# Altium project Mirny.PrjPCB (part 1 of 4)
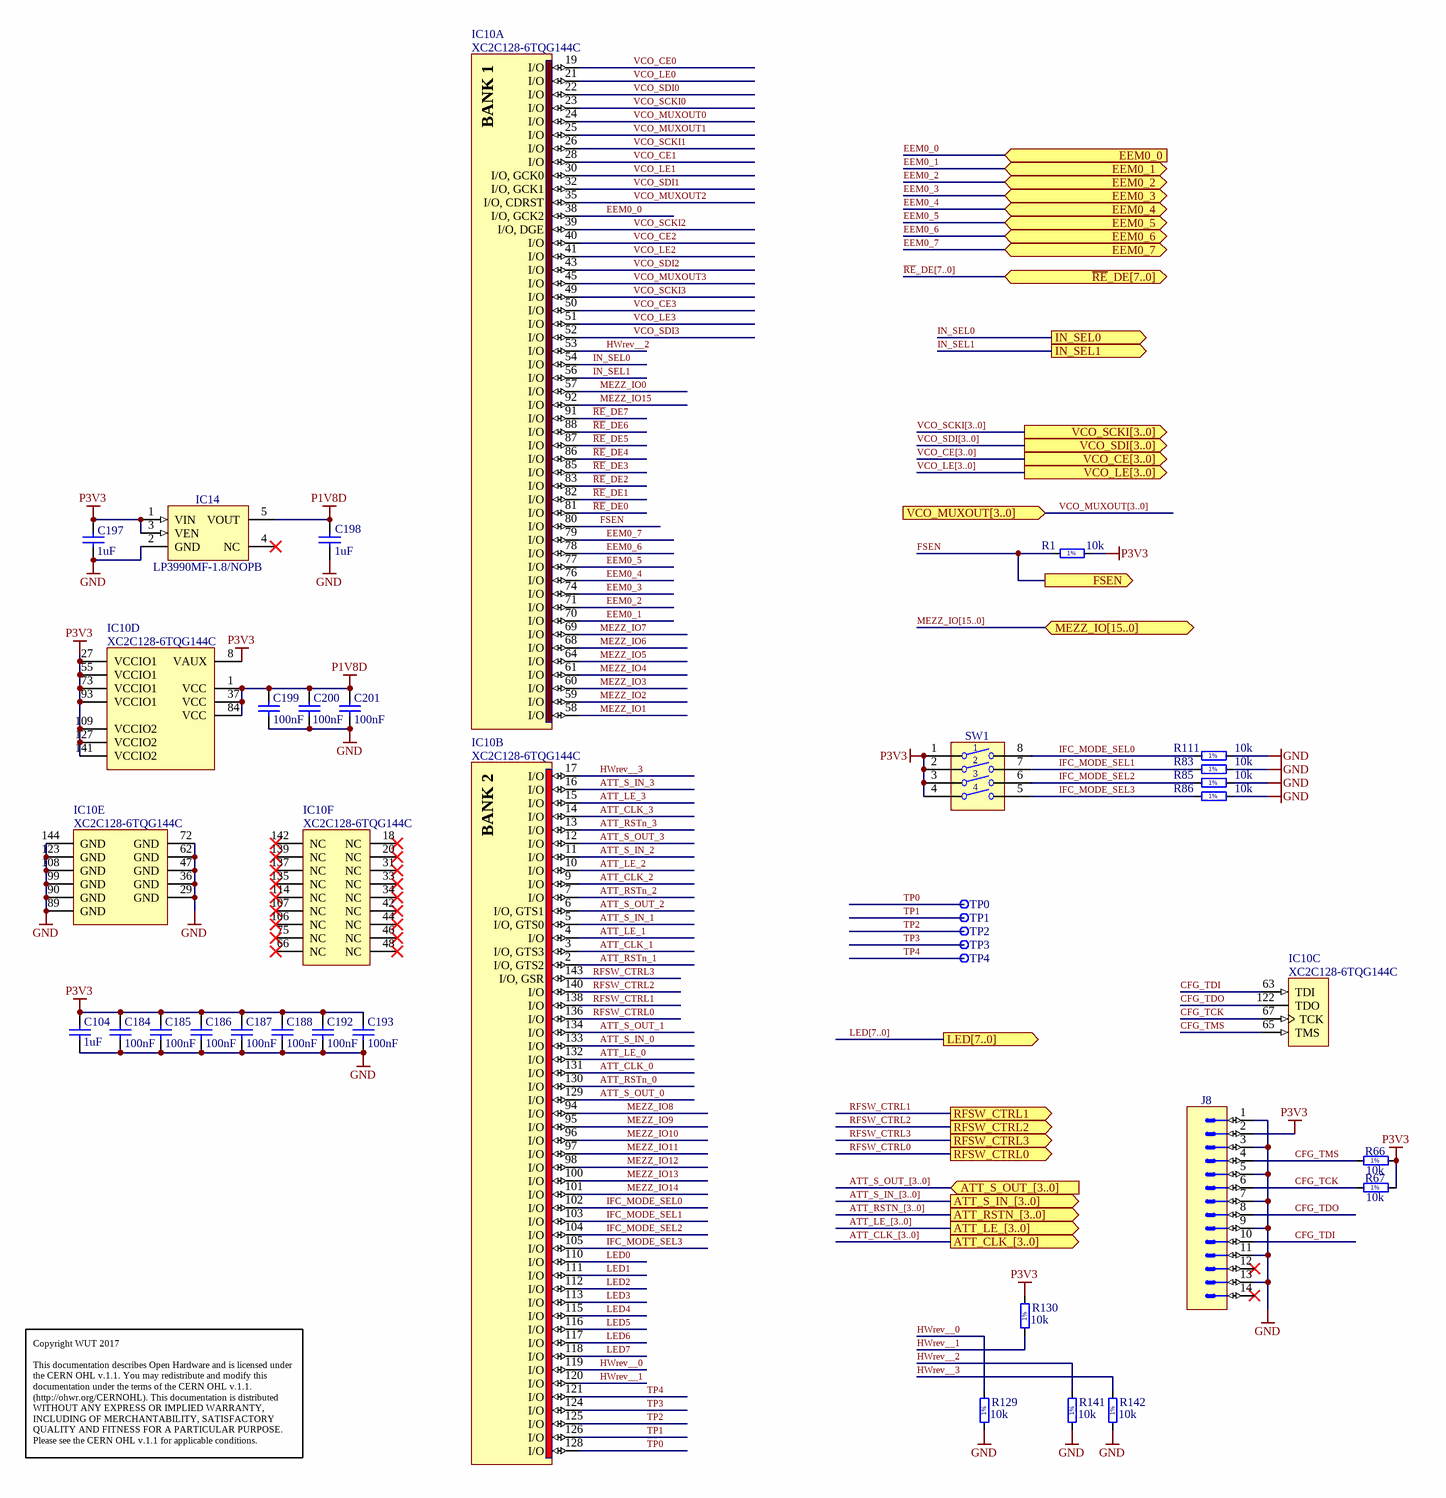
[diagram p0: CTRL_LOGIC.SchDoc]
P_version: 1.1.4
8 sheets, 822 parts. Net scope: hierarchical (ports join the sheet entries above them; power ports are global).
Board file: Mirny.PcbDoc
Sheets:
  CTRL_LOGIC.SchDoc
  Mirny.schdoc
    U_VCO_channel0 = VCO_channel.SchDoc
    U_VCO_OUT_channel0 = VCO_OUT_channel.SchDoc
    U_VCO_OUT_channel1 = VCO_OUT_channel.SchDoc
    U_VCO_OUT_channel2 = VCO_OUT_channel.SchDoc
    U_VCO_OUT_channel3 = VCO_OUT_channel.SchDoc
    U_VCO_channel1 = VCO_channel.SchDoc
    U_VCO_channel2 = VCO_channel.SchDoc
    U_VCO_channel3 = VCO_channel.SchDoc
    U_CLK_INPUT = CLK_INPUT.SchDoc
    U_B2B_Connectors = B2B_connectors.SchDoc
  LVDS_IFC_VCO.SchDoc
  Supply_Mirny.SchDoc

## Sheet CTRL_LOGIC.SchDoc: CPLD logic
size 420 x 297 mm; Author: K.B.; CompanyName: WUT; DrawnBy: K.B.; Organization: WUT ISE; Address1: Warsaw Univeristy of Technology; Address2: Nowowiejska 15/19; DocumentNumber: 2; Revision: 1.1.4; SheetNumber: 2; SheetTotal: 8; EDA_Number: ARTIQ; Projet: ARTIQ/SINARA; ModifiedBy: -; CreateDate: XX/XX/XXXX; CheckedDate: -; Title2: & option switches; DivGrp: ISE; Designer: K.B.; ModifiedDate: -; ProjectName: ARTIQ/SINARA

### Parts
(Parts that share a designator on the sheet are numbered #1, #2 ... from top to bottom, then left to right.)
C104  1uF  [CAPC1005X55N]
C184  100nF  [CAPC1005X55N]
C185  100nF  [CAPC1005X55N]
C186  100nF  [CAPC1005X55N]
C187  100nF  [CAPC1005X55N]
C188  100nF  [CAPC1005X55N]
C192  100nF  [CAPC1005X55N]
C193  100nF  [CAPC1005X55N]
C197  1uF  [CAPC1005X55N]
C198  1uF  [CAPC1005X55N]
C199  100nF  [CAPC1005X55N]
C200  100nF  [CAPC1005X55N]
C201  100nF  [CAPC1005X55N]
IC10  XC2C128-6TQG144C  [QFP50P2200X2200X160-144N]  (parts A,B,C,D,E,F of 6)
IC14  LP3990MF-1.8/NOPB  [SOT95P284X122-5N]
J8  Milli-Grid™  [MOLEX_87832-1420]  (value not drawn)
R1#1  10k  [RESC1005X40N]
R66  10k  [RESC1005X40N]
R67  10k  [RESC1005X40N]
R83  10k  [RESC1005X40N]
R85  10k  [RESC1005X40N]
R86  10k  [RESC1005X40N]
R111  10k  [RESC1005X40N]
R129  10k  [RESC1005X40N]
R130  10k  [RESC1005X40N]
R141  10k  [RESC1005X40N]
R142  10k  [RESC1005X40N]
SW1  Switch  [SW_OMRON_A6S-4102-H]  (value not drawn)
TP0  Test Point  [TPS127]  (value not drawn)
TP1  Test Point  [TPS127]  (value not drawn)
TP2  Test Point  [TPS127]  (value not drawn)
TP3  Test Point  [TPS127]  (value not drawn)
TP4  Test Point  [TPS127]  (value not drawn)

### Ports
ATT_CLK_[3..0] (out), ATT_LE_[3..0] (out), ATT_RSTN_[3..0] (out), ATT_S_IN_[3..0] (out), ATT_S_OUT_[3..0] (in), EEM0_0 (in), EEM0_1 (bidir), EEM0_2 (bidir), EEM0_3 (bidir), EEM0_4 (bidir), EEM0_5 (bidir), EEM0_6 (bidir), EEM0_7 (bidir), FSEN (out), IN_SEL0 (out), IN_SEL1 (out), LED[7..0] (out), MEZZ_IO[15..0] (bidir), RFSW_CTRL0 (out), RFSW_CTRL1 (out), RFSW_CTRL2 (out), RFSW_CTRL3 (out), VCO_CE[3..0] (out), VCO_LE[3..0] (out), VCO_MUXOUT[3..0] (in), VCO_SCKI[3..0] (out), VCO_SDI[3..0] (out), ~{RE}_DE[7..0] (bidir)

### Nets
GND: C104.1 C184.1 C185.1 C186.1 C187.1 C188.1 C192.1 C193.1 C197.1 C198.1 C199.1 C200.1 C201.1 IC10.29(GND) IC10.36(GND) IC10.47(GND) IC10.62(GND) IC10.72(GND) IC10.89(GND) IC10.90(GND) IC10.99(GND) IC10.108(GND) IC10.123(GND) IC10.144(GND) IC14.2(GND) J8.1 J8.3 J8.5 J8.7 J8.9 J8.11 J8.13 R83.2 R85.2 R86.2 R111.2 R129.1 R141.1 R142.1
P1V8D: C198.2 C199.2 C200.2 C201.2 IC10.1(VCC) IC10.37(VCC) IC10.84(VCC) IC14.5(VOUT)
P3V3: C104.2 C184.2 C185.2 C186.2 C187.2 C188.2 C192.2 C193.2 C197.2 IC10.8(VAUX) IC10.27(VCCIO1) IC10.55(VCCIO1) IC10.73(VCCIO1) IC10.93(VCCIO1) IC10.109(VCCIO2) IC10.127(VCCIO2) IC10.141(VCCIO2) IC14.1(VIN) IC14.3(VEN) J8.2 R1#1.2 R66.2 R67.2 R130.2 SW1.1 SW1.2 SW1.3 SW1.4
ATT_CLK_0: IC10.131(I/O)
ATT_CLK_1: IC10.3(I/O,_GTS3)
ATT_CLK_2: IC10.9(I/O)
ATT_CLK_3: IC10.14(I/O)
ATT_LE_0: IC10.132(I/O)
ATT_LE_1: IC10.4(I/O)
ATT_LE_2: IC10.10(I/O)
ATT_LE_3: IC10.15(I/O)
ATT_RSTn_0: IC10.130(I/O)
ATT_RSTn_1: IC10.2(I/O,_GTS2)
ATT_RSTn_2: IC10.7(I/O)
ATT_RSTn_3: IC10.13(I/O)
ATT_S_IN_0: IC10.133(I/O)
ATT_S_IN_1: IC10.5(I/O,_GTS0)
ATT_S_IN_2: IC10.11(I/O)
ATT_S_IN_3: IC10.16(I/O)
ATT_S_OUT_0: IC10.129(I/O)
ATT_S_OUT_1: IC10.134(I/O)
ATT_S_OUT_2: IC10.6(I/O,_GTS1)
ATT_S_OUT_3: IC10.12(I/O)
CFG_TCK: IC10.67(TCK) J8.6 R67.1
CFG_TDI: IC10.63(TDI) J8.10
CFG_TDO: IC10.122(TDO) J8.8
CFG_TMS: IC10.65(TMS) J8.4 R66.1
EEM0_0: IC10.38(I/O,_GCK2) ; port EEM0_0
EEM0_1: IC10.70(I/O) ; port EEM0_1
EEM0_2: IC10.71(I/O) ; port EEM0_2
EEM0_3: IC10.74(I/O) ; port EEM0_3
EEM0_4: IC10.76(I/O) ; port EEM0_4
EEM0_5: IC10.77(I/O) ; port EEM0_5
EEM0_6: IC10.78(I/O) ; port EEM0_6
EEM0_7: IC10.79(I/O) ; port EEM0_7
FSEN: IC10.80(I/O) R1#1.1 ; port FSEN
HWrev__0: IC10.119(I/O) R129.2
HWrev__1: IC10.120(I/O) R130.1
HWrev__2: IC10.53(I/O) R141.2
HWrev__3: IC10.17(I/O) R142.2
IFC_MODE_SEL0: IC10.102(I/O) R111.1 SW1.8
IFC_MODE_SEL1: IC10.103(I/O) R83.1 SW1.7
IFC_MODE_SEL2: IC10.104(I/O) R85.1 SW1.6
IFC_MODE_SEL3: IC10.105(I/O) R86.1 SW1.5
IN_SEL0: IC10.54(I/O) ; port IN_SEL0
IN_SEL1: IC10.56(I/O) ; port IN_SEL1
LED0: IC10.110(I/O)
LED1: IC10.111(I/O)
LED2: IC10.112(I/O)
LED3: IC10.113(I/O)
LED4: IC10.115(I/O)
LED5: IC10.116(I/O)
LED6: IC10.117(I/O)
LED7: IC10.118(I/O)
MEZZ_IO0: IC10.57(I/O)
MEZZ_IO1: IC10.58(I/O)
MEZZ_IO2: IC10.59(I/O)
MEZZ_IO3: IC10.60(I/O)
MEZZ_IO4: IC10.61(I/O)
MEZZ_IO5: IC10.64(I/O)
MEZZ_IO6: IC10.68(I/O)
MEZZ_IO7: IC10.69(I/O)
MEZZ_IO8: IC10.94(I/O)
MEZZ_IO9: IC10.95(I/O)
MEZZ_IO10: IC10.96(I/O)
MEZZ_IO11: IC10.97(I/O)
MEZZ_IO12: IC10.98(I/O)
MEZZ_IO13: IC10.100(I/O)
MEZZ_IO14: IC10.101(I/O)
MEZZ_IO15: IC10.92(I/O)
~{RE}_DE0: IC10.81(I/O)
~{RE}_DE1: IC10.82(I/O)
~{RE}_DE2: IC10.83(I/O)
~{RE}_DE3: IC10.85(I/O)
~{RE}_DE4: IC10.86(I/O)
~{RE}_DE5: IC10.87(I/O)
~{RE}_DE6: IC10.88(I/O)
~{RE}_DE7: IC10.91(I/O)
RFSW_CTRL0: IC10.136(I/O) ; port RFSW_CTRL0
RFSW_CTRL1: IC10.138(I/O) ; port RFSW_CTRL1
RFSW_CTRL2: IC10.140(I/O) ; port RFSW_CTRL2
RFSW_CTRL3: IC10.143(I/O,_GSR) ; port RFSW_CTRL3
TP0: IC10.128(I/O) TP0.1
TP1: IC10.126(I/O) TP1.1
TP2: IC10.125(I/O) TP2.1
TP3: IC10.124(I/O) TP3.1
TP4: IC10.121(I/O) TP4.1
VCO_CE0: IC10.19(I/O)
VCO_CE1: IC10.28(I/O)
VCO_CE2: IC10.40(I/O)
VCO_CE3: IC10.50(I/O)
VCO_LE0: IC10.21(I/O)
VCO_LE1: IC10.30(I/O,_GCK0)
VCO_LE2: IC10.41(I/O)
VCO_LE3: IC10.51(I/O)
VCO_MUXOUT0: IC10.24(I/O)
VCO_MUXOUT1: IC10.25(I/O)
VCO_MUXOUT2: IC10.35(I/O,_CDRST)
VCO_MUXOUT3: IC10.45(I/O)
VCO_SCKI0: IC10.23(I/O)
VCO_SCKI1: IC10.26(I/O)
VCO_SCKI2: IC10.39(I/O,_DGE)
VCO_SCKI3: IC10.49(I/O)
VCO_SDI0: IC10.22(I/O)
VCO_SDI1: IC10.32(I/O,_GCK1)
VCO_SDI2: IC10.43(I/O)
VCO_SDI3: IC10.52(I/O)

Not connected (* = marked no-connect by the designer): IC10 18(NC)* 20(NC)* 31(NC)* 33(NC)* 34(NC)* 42(NC)* 44(NC)* 46(NC)* 48(NC)* 66(NC)* 75(NC)* 106(NC)* 107(NC)* 114(NC)* 135(NC)* 137(NC)* 139(NC)* 142(NC)*; IC14 4(NC)*; J8 12* 14*

### Buses and harness runs
bus ATT_CLK_[3..0] = port ATT_CLK_[3..0]
bus ATT_LE_[3..0] = port ATT_LE_[3..0]
bus ATT_RSTN_[3..0] = port ATT_RSTN_[3..0]
bus ATT_S_IN_[3..0] = port ATT_S_IN_[3..0]
bus ATT_S_OUT_[3..0] = port ATT_S_OUT_[3..0]
bus LED[7..0] = port LED[7..0]
bus MEZZ_IO[15..0] = port MEZZ_IO[15..0]
bus VCO_CE[3..0] = port VCO_CE[3..0]
bus VCO_LE[3..0] = port VCO_LE[3..0]
bus VCO_MUXOUT[3..0] = port VCO_MUXOUT[3..0]
bus VCO_SCKI[3..0] = port VCO_SCKI[3..0]
bus VCO_SDI[3..0] = port VCO_SDI[3..0]
bus ~{RE}_DE[7..0] = port ~{RE}_DE[7..0]

### Notes on the sheet
- Copyright WUT 2017
  This documentation describes Open Hardware and is licensed under the CERN OHL v.1.1. You may redistribute and modify this documentation under the terms of the CERN OHL v.1.1. (http://ohwr.org/CERNOHL). This documentation is distributed WITHOUT ANY EXPRESS OR IMPLIED WARRANTY, INCLUDING OF MERCHANTABILITY, SATISFACTORY QUALITY AND FITNESS FOR A PARTICULAR PURPOSE. Please see the CERN OHL v.1.1 for applicable conditions.
- Project/Equipment
- Document
- Designer
- Drawn by
- Check.by
- File
- Last Mod.
- Print Date
- Sheet
- Size
- A3
- of
- Rev
- (in symbol R0402_10K_1%_0.0625W_100PPM) 1%
- (in symbol XC2C128-6TQG144C, part A) BANK 1
- (in symbol XC2C128-6TQG144C, part B) BANK 2

### Library data of the parts
C104 C197 C198 = CC0402_1UF_16V_10%_X5R: Non-polarised capacitor; Part Description: SMD Multilayer Chip Ceramic Capacitor; Manufacturer: GENERIC; Manufacturer1 Part Number: C1005X5R1C105KT; Voltage: 16V; TC: X5R; Tolerance: ±10%; Part Number: CC0402_1UF_16V_10%_X5R; Component Kind: Standard; Component Type: Standard; Pin Count: 2; Value: 1uF; Status: Preferred; Manufacturer Part Number: CC0402_1UF_16V_10%_X5R; Case: 0402; Mounted: Yes; Socket: No; SMD: Yes; Sense: No; Manufacturer1 Example: TDK; Manufacturer1 ComponentHeight: 0.55mm; HelpURL: \\cern.ch\dfs\Applications\Altium\Datasheets\CC0402_X5R_TDK_C.pdf; Author: CERN DEM JLC; CreateDate: 2012-10-25; LatestRevisionDate: 2012-10-25
C184-C188 C192 C193 C199-C201 = CC0402_100NF_16V_10%_X5R: Non-polarised capacitor; Part Description: SMD Multilayer Chip Ceramic Capacitor; Manufacturer: GENERIC; Manufacturer1 Part Number: GRM155R61C104KA88D; Voltage: 16V; TC: X5R; Tolerance: ±10%; Part Number: CC0402_100NF_16V_10%_X5R; Component Kind: Standard; Component Type: Standard; Pin Count: 2; Value: 100nF; Status: None; Manufacturer Part Number: CC0402_100NF_16V_10%_X5R; Case: 0402; Mounted: Yes; Socket: No; SMD: Yes; Sense: No; Manufacturer1 Example: MURATA; Manufacturer1 ComponentHeight: 0.55mm; HelpURL: \\cern.ch\dfs\Applications\Altium\Datasheets\CC0402_X5R_MURATA_GRM.pdf; Author: CERN DEM JLC; CreateDate: 10.12.2013; LatestRevisionDate: 10.12.2013
IC10 = XC2C128-6TQG144C: CoolRunner-II 1.8V, 128 Macrocell CPLD, 100 User I/Os, 144-Pin TQFP, Commercial Grade, Pb-Free; Manufacturer: XILINX; PressFit: No; Bonding: No; Part Number: XC2C128-6TQG144C; Component Kind: Standard; Component Type: Standard; Device: XC2C128-6TQG144C; PackageDescription: QFP, 144-Leads, Body 20x20mm (BSC), Pitch 0.50mm, IPC Medium Density; Part Description: CoolRunner-II 1.8V, 128 Macrocell CPLD, 100 User I/Os, 144-Pin TQFP, Commercial Grade, Pb-Free; Manufacturer Part Number: XC2C128-6TQG144C; Pin Count: 144; Case: QFP144; Mounted: Yes; Socket: No; SMD: Yes; Sense: No; ComponentHeight: 1.6mm; HelpURL: \\cern.ch\dfs\Applications\Altium\Datasheets\XC2C128-6TQG144C.pdf; ComponentLink1URL: \\cern.ch\dfs\Applications\Altium\Datasheets\XC2C128-6TQG144C_Package.pdf; ComponentLink1Description: Package Drawing; Author: CERN DEM JLC; CreateDate: 16.11.2010; LatestRevisionDate: 16.11.2010
IC14 = LP3990MF-1.8/NOPB: 1.8V, 150mA Linear Voltage Regulator For Digital Applications; Manufacturer: TEXAS INSTRUMENTS; PressFit: No; Bonding: No; Part Number: LP3990MF-1.8/NOPB; Component Kind: Standard; Component Type: Standard; Device: LP3990MF-1.8/NOPB; PackageDescription: SOT23 5, Pitch 0.95mm - Body 1.67x2.99mm, IPC Medium Density; Part Description: 1.8V, 150mA Linear Voltage Regulator For Digital Applications; Manufacturer Part Number: LP3990MF-1.8/NOPB; Pin Count: 5; Case: SOT23-5; Mounted: Yes; Socket: No; SMD: Yes; Sense: No; ComponentHeight: 1.19mm; HelpURL: \\cern.ch\dfs\Applications\Altium\Datasheets\LP3990MF-1.8-NOPB.pdf; Author: CERN DEM JLC; CreateDate: 19.01.2011; LatestRevisionDate: 16.09.2014
J8 = MOLEX_87832-1420: Connector 14 Male; Part Description: 2.00mm (.079") Pitch Milli-Grid™ Header, Surface Mount, Vertical, Shrouded, 14 Circuits,with Locking Windows and Centre Polarization Slot, PCB Locator; Manufacturer: MOLEX; PressFit: No; Part Number: MOLEX_87832-1420; Component Kind: Standard; Component Type: Standard; Pin Count: 14; Family: Milli-Grid™; Mounted: Yes; Socket: No; SMD: Yes; Sense: No; Status: None; Manufacturer Part Number: 87832-1420; ComponentHeight: 7.6mm; HelpURL: \\cern.ch\dfs\Applications\Altium\Datasheets\MOLEX_87832-1420.pdf; Author: CERN DEM JLC; CreateDate: 09.09.2008; LatestRevisionDate: 09.09.2008
R1#1 R66 R67 R83 R85 R86 R111 R129 R130 R141 R142 = R0402_10K_1%_0.0625W_100PPM: Resistor - 1%; Part Description: General Purpose Thick Film Chip Resistor; Manufacturer: GENERIC; Manufacturer1 Part Number: 232270671003L; TC: ±100ppm/°C; Part Number: R0402_10K_1%_0.0625W_100PPM; Component Kind: Standard; Component Type: Standard; Pin Count: 2; Value: 10k; Status: Not recommended; Power: 0.0625W; Tolerance: ±1%; Manufacturer Part Number: R0402_10K_1%_0.0625W_100PPM; Case: 0402; Mounted: Yes; Sense: No; Socket: No; SMD: Yes; Manufacturer1 Example: YAGEO PHYCOMP; Manufacturer1 ComponentHeight: 0.4mm; HelpURL: \\cern.ch\dfs\Applications\Altium\Datasheets\R0402_Phycomp_RC0402.pdf; Author: CERN DEM JLC; CreateDate: 03.12.2007; LatestRevisionDate: 17.10.2012
SW1 = SW_OMRON_A6S-4102-H: 4 Ways SPST DIP Switch; Part Description: 4 Ways SPST DIP Switch, White Flat Actuator with Seal Tape, Contact Rating 25mA 24VDC; Manufacturer: OMRON; PressFit: No; Part Number: SW_OMRON_A6S-4102-H; Component Kind: Standard; Component Type: Standard; Pin Count: 8; PackageDescription: Pitch 2.54mm, Body 11.3x6.4mm, 4 Ways SPST Surface-Mounting DIP Switch, OMRON A6S-H; Family: Switch; Mounted: Yes; Socket: No; SMD: Yes; Sense: No; Status: None; Manufacturer Part Number: A6S-4102-H; ComponentHeight: 3.8mm; HelpURL: \\cern.ch\dfs\Applications\Altium\Datasheets\SW_OMRON_A6S-4102-H.pdf; Author: CERN DEM JMW; CreateDate: 25.09.2008; LatestRevisionDate: 25.09.2008
TP0-TP4 = SMD_PAD_1.27X1.27MM: Part Description: 1.27mm x 1.27mm PCB Copper Area (SMD Test Point); Mounted: No; Part Number: SMD_PAD_1.27X1.27MM; Component Kind: Standard (No BOM); Component Type: Standard (No BOM); Pin Count: 1; Family: Test Point; Socket: No; SMD: Yes; Sense: No; Status: None; ComponentHeight: 0mm; HelpURL: Undefined; Author: CERN DEM JLC; CreateDate: 12.01.2008; LatestRevisionDate: 12.01.2008; PackageDescription: 1.27mm x 1.27mm PCB Copper Area (SMD Test Point)

## Sheet Mirny.schdoc: Mirny
size A2; EDA_Number: ARTIQ; Projet: ARTIQ/SINARA; Author: M.Beldyga; CompanyName: WUT ISE; DrawnBy: K.B; Organization: WUT ISE; Address1: PW ISE; Address2: Nowowiejska 15/19 00-665 Warsaw; Address3: micbeldyga@gmail.com; SheetNumber: 1; SheetTotal: 10; ModifiedBy: M. Beldyga; CheckedDate: -; DivGrp: WUT ISE; Designer: K.B; ModifiedDate: -; ProjectName: Sensor Box
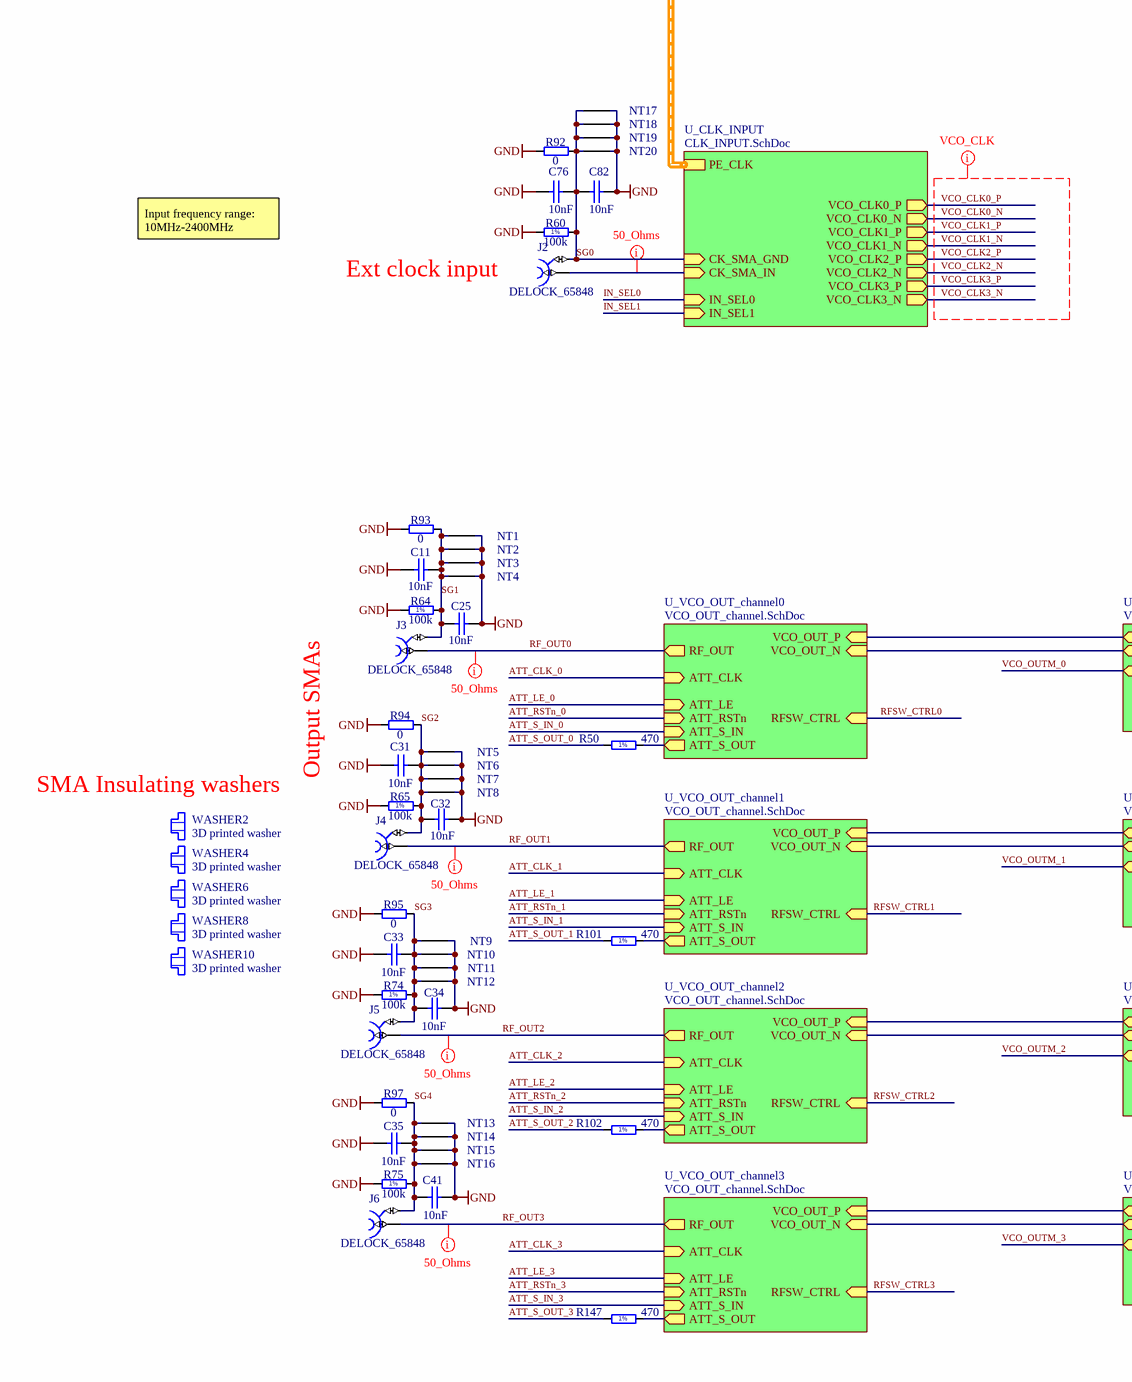
[diagram p1: Mirny.schdoc, left]
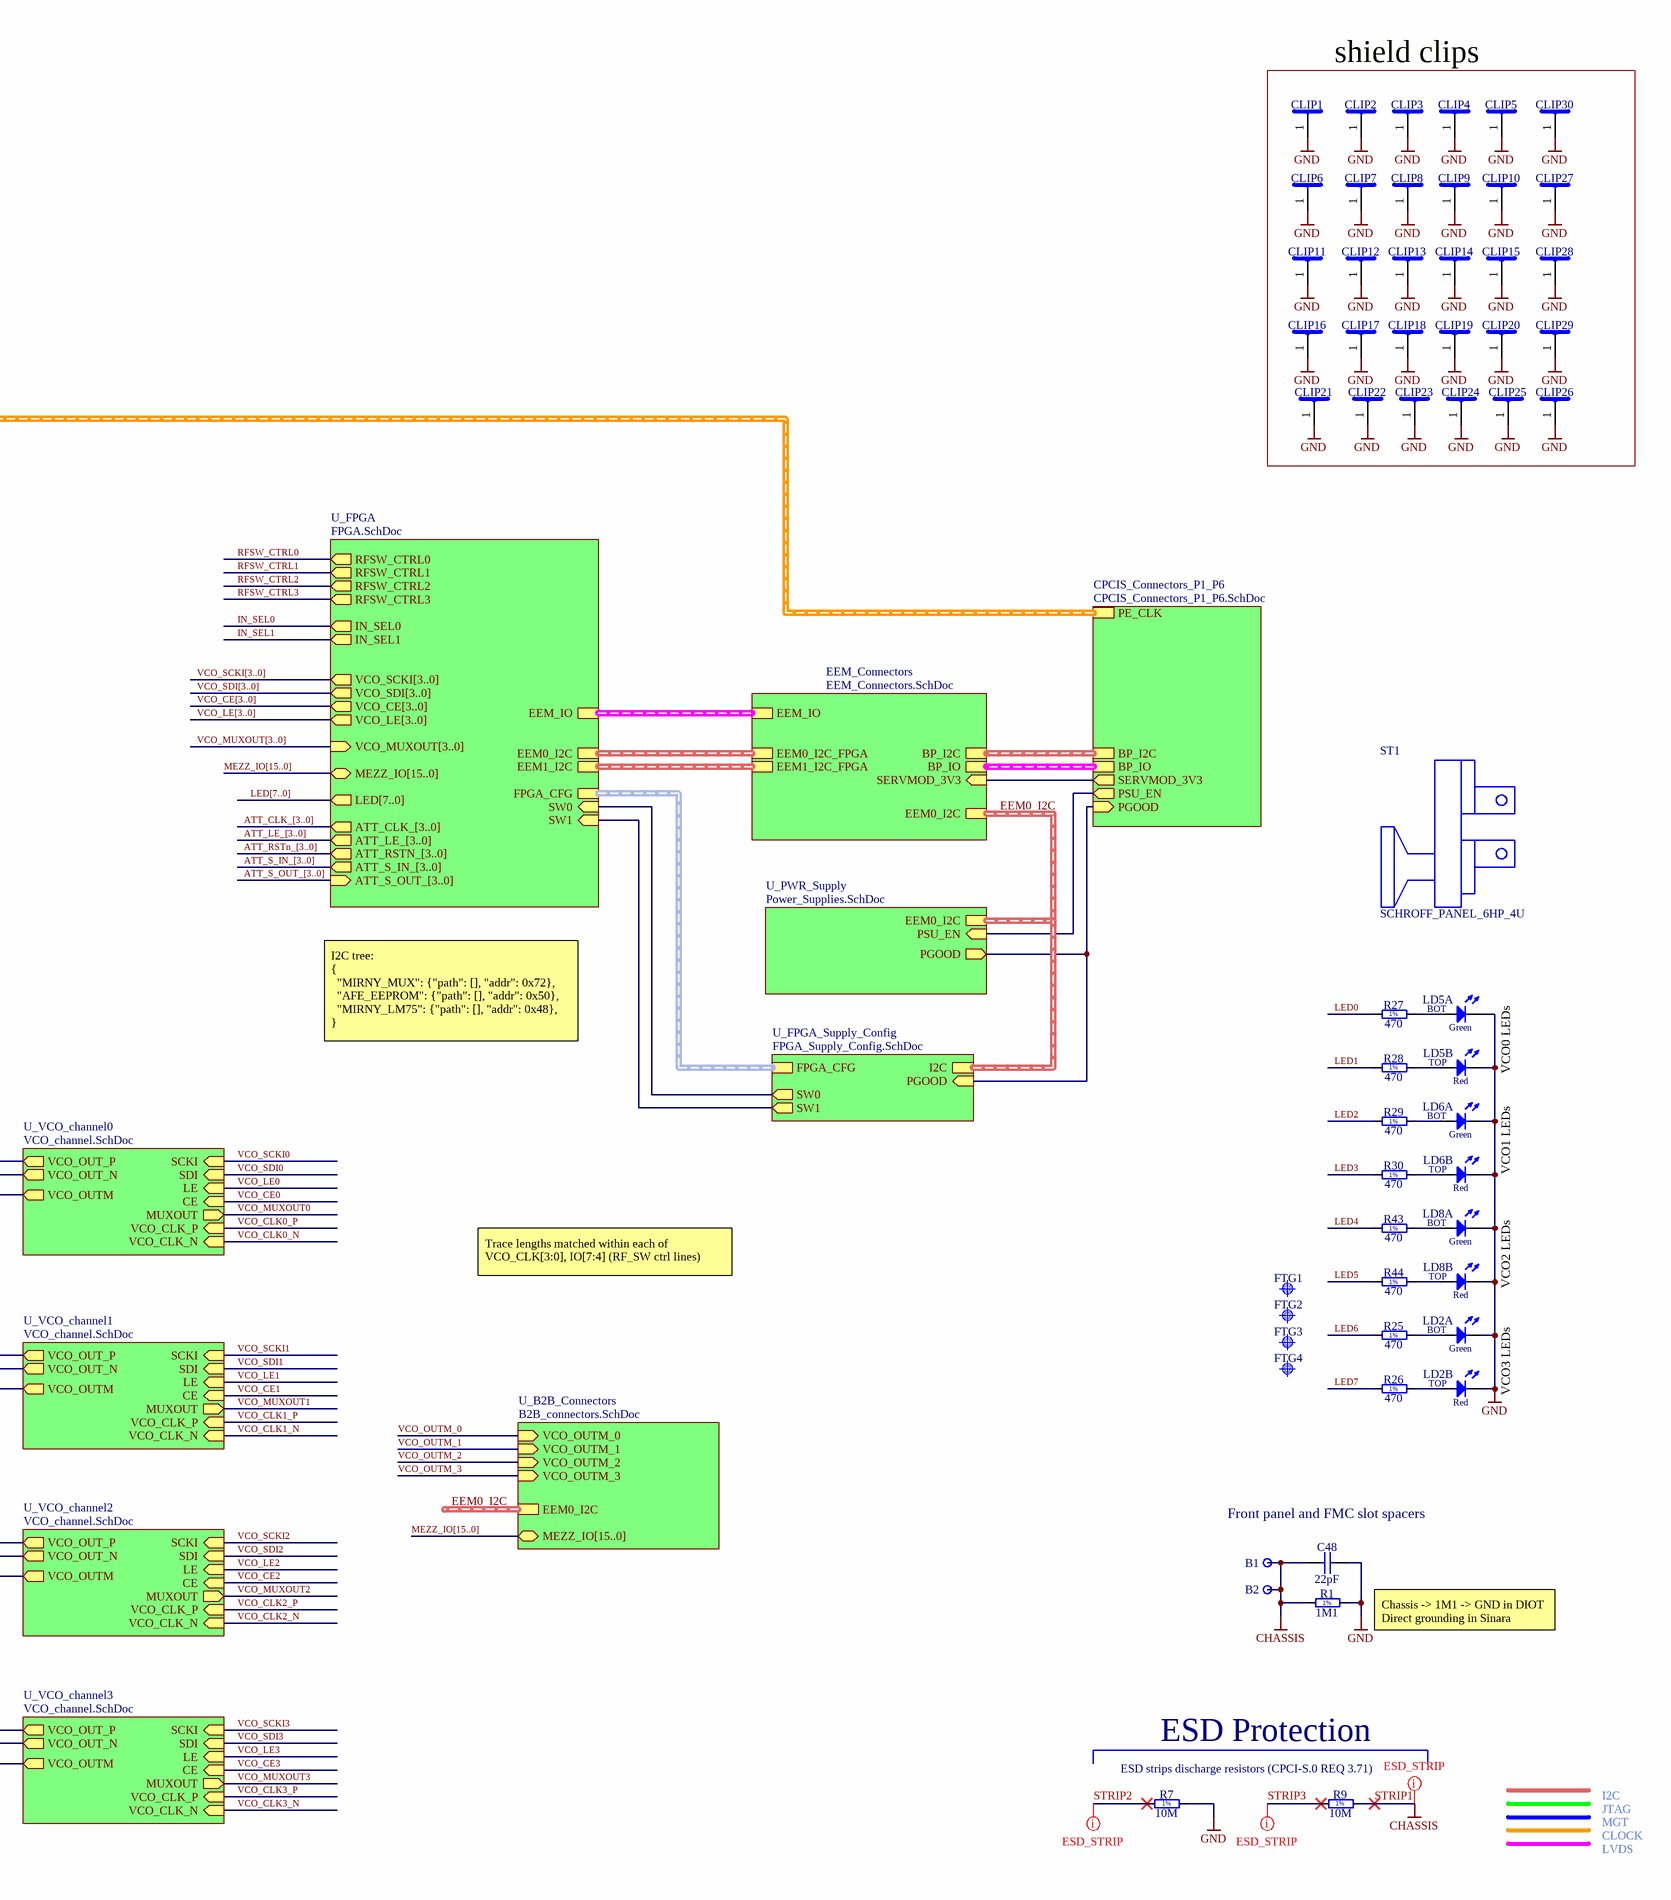
[diagram p2: Mirny.schdoc, right]

### Parts
(Parts that share a designator on the sheet are numbered #1, #2 ... from top to bottom, then left to right.)
B1  Plated Hole  [MTG270_500]  (value not drawn)  (no BOM)
B2  Plated Hole  [MTG270_500]  (value not drawn)  (no BOM)
C11  10nF  [CAPC1005X55N]
C25  10nF  [CAPC1005X55N]
C31  10nF  [CAPC1005X55N]
C32  10nF  [CAPC1005X55N]
C33  10nF  [CAPC1005X55N]
C34  10nF  [CAPC1005X55N]
C35  10nF  [CAPC1005X55N]
C41  10nF  [CAPC1005X55N]
C48#1  22pF  [CAPC1005X55N]
C76  10nF  [CAPC1005X55N]
C82  10nF  [CAPC1005X55N]
CLIP1  S1411-46R  [CLIP_HOLLAND-SHIELDING_LC]  (value not drawn)
CLIP2  S1411-46R  [CLIP_HOLLAND-SHIELDING_LC]  (value not drawn)
CLIP3  S1411-46R  [CLIP_HOLLAND-SHIELDING_LC]  (value not drawn)
CLIP4  S1411-46R  [CLIP_HOLLAND-SHIELDING_LC]  (value not drawn)
CLIP5  S1411-46R  [CLIP_HOLLAND-SHIELDING_LC]  (value not drawn)
CLIP6  S1411-46R  [CLIP_HOLLAND-SHIELDING_LC]  (value not drawn)
CLIP7  S1411-46R  [CLIP_HOLLAND-SHIELDING_LC]  (value not drawn)
CLIP8  S1411-46R  [CLIP_HOLLAND-SHIELDING_LC]  (value not drawn)
CLIP9  S1411-46R  [CLIP_HOLLAND-SHIELDING_LC]  (value not drawn)
CLIP10  S1411-46R  [CLIP_HOLLAND-SHIELDING_LC]  (value not drawn)
CLIP11  S1411-46R  [CLIP_HOLLAND-SHIELDING_LC]  (value not drawn)
CLIP12  S1411-46R  [CLIP_HOLLAND-SHIELDING_LC]  (value not drawn)
CLIP13  S1411-46R  [CLIP_HOLLAND-SHIELDING_LC]  (value not drawn)
CLIP14  S1411-46R  [CLIP_HOLLAND-SHIELDING_LC]  (value not drawn)
CLIP15  S1411-46R  [CLIP_HOLLAND-SHIELDING_LC]  (value not drawn)
CLIP16  S1411-46R  [CLIP_HOLLAND-SHIELDING_LC]  (value not drawn)
CLIP17  S1411-46R  [CLIP_HOLLAND-SHIELDING_LC]  (value not drawn)
CLIP18  S1411-46R  [CLIP_HOLLAND-SHIELDING_LC]  (value not drawn)
CLIP19  S1411-46R  [CLIP_HOLLAND-SHIELDING_LC]  (value not drawn)
CLIP20  S1411-46R  [CLIP_HOLLAND-SHIELDING_LC]  (value not drawn)
CLIP21  S1411-46R  [CLIP_HOLLAND-SHIELDING_LC]  (value not drawn)
CLIP22  S1411-46R  [CLIP_HOLLAND-SHIELDING_LC]  (value not drawn)
CLIP23  S1411-46R  [CLIP_HOLLAND-SHIELDING_LC]  (value not drawn)
CLIP24  S1411-46R  [CLIP_HOLLAND-SHIELDING_LC]  (value not drawn)
CLIP25  S1411-46R  [CLIP_HOLLAND-SHIELDING_LC]  (value not drawn)
CLIP26  S1411-46R  [CLIP_HOLLAND-SHIELDING_LC]  (value not drawn)
CLIP27  S1411-46R  [CLIP_HOLLAND-SHIELDING_LC]  (value not drawn)
CLIP28  S1411-46R  [CLIP_HOLLAND-SHIELDING_LC]  (value not drawn)
CLIP29  S1411-46R  [CLIP_HOLLAND-SHIELDING_LC]  (value not drawn)
CLIP30  S1411-46R  [CLIP_HOLLAND-SHIELDING_LC]  (value not drawn)
FTG1  Use only in PCB  [FIDUCIAL_TOP_C100-200]  (value not drawn)  (no BOM)
FTG2  Use only in PCB  [FIDUCIAL_TOP_S100-200]  (value not drawn)  (no BOM)
FTG3  Use only in PCB  [FIDUCIAL_TOP_S200-400]  (value not drawn)  (no BOM)
FTG4  Use only in PCB  [FIDUCIAL_TOP_S100-200]  (value not drawn)  (no BOM)
J2  DELOCK_65848  [Delock]
J3  DELOCK_65848  [Delock]
J4  DELOCK_65848  [Delock]
J5  DELOCK_65848  [Delock]
J6  DELOCK_65848  [Delock]
LD2  Red/Green  [LED_DIALIGHT_571-0112F]  (value not drawn)  (parts A,B of 2)
LD5  Red/Green  [LED_DIALIGHT_571-0112F]  (value not drawn)  (parts A,B of 2)
LD6  Red/Green  [LED_DIALIGHT_571-0112F]  (value not drawn)  (parts A,B of 2)
LD8  Red/Green  [LED_DIALIGHT_571-0112F]  (value not drawn)  (parts A,B of 2)
NT1  Net Tie  [Net Tie]  (value not drawn)  (net tie, no BOM)
NT2  Net Tie  [Net Tie]  (value not drawn)  (net tie, no BOM)
NT3  Net Tie  [Net Tie]  (value not drawn)  (net tie, no BOM)
NT4  Net Tie  [Net Tie]  (value not drawn)  (net tie, no BOM)
NT5  Net Tie  [Net Tie]  (value not drawn)  (net tie, no BOM)
NT6  Net Tie  [Net Tie]  (value not drawn)  (net tie, no BOM)
NT7  Net Tie  [Net Tie]  (value not drawn)  (net tie, no BOM)
NT8  Net Tie  [Net Tie]  (value not drawn)  (net tie, no BOM)
NT9  Net Tie  [Net Tie]  (value not drawn)  (net tie, no BOM)
NT10  Net Tie  [Net Tie]  (value not drawn)  (net tie, no BOM)
NT11  Net Tie  [Net Tie]  (value not drawn)  (net tie, no BOM)
NT12  Net Tie  [Net Tie]  (value not drawn)  (net tie, no BOM)
NT13  Net Tie  [Net Tie]  (value not drawn)  (net tie, no BOM)
NT14  Net Tie  [Net Tie]  (value not drawn)  (net tie, no BOM)
NT15  Net Tie  [Net Tie]  (value not drawn)  (net tie, no BOM)
NT16  Net Tie  [Net Tie]  (value not drawn)  (net tie, no BOM)
NT17  Net Tie  [Net Tie]  (value not drawn)  (net tie, no BOM)
NT18  Net Tie  [Net Tie]  (value not drawn)  (net tie, no BOM)
NT19  Net Tie  [Net Tie]  (value not drawn)  (net tie, no BOM)
NT20  Net Tie  [Net Tie]  (value not drawn)  (net tie, no BOM)
R1#2  1M1  [RESC2012X60N]
R7#1  10M  [RESC2113X55N]
R9#1  10M  [RESC2113X55N]
R25  470  [RESC1005X40N]
R26  470  [RESC1005X40N]
R27  470  [RESC1005X40N]
R28  470  [RESC1005X40N]
R29  470  [RESC1005X40N]
R30  470  [RESC1005X40N]
R43  470  [RESC1005X40N]
R44  470  [RESC1005X40N]
R50  470  [RESC1005X40N]
R60  100k  [RESC1005X40N]
R64  100k  [RESC1005X40N]
R65  100k  [RESC1005X40N]
R74  100k  [RESC1005X40N]
R75  100k  [RESC1005X40N]
R92  0  [RESC1608X55N]
R93  0  [RESC1608X55N]
R94  0  [RESC1608X55N]
R95  0  [RESC1608X55N]
R97  0  [RESC1608X55N]
R101  470  [RESC1005X40N]
R102  470  [RESC1005X40N]
R147  470  [RESC1005X40N]
ST1  SCHROFF_PANEL_6HP_4U  (mechanical)
WASHER2  3D printed washer  [Keystone_7687]
WASHER4  3D printed washer  [Keystone_7687]
WASHER6  3D printed washer  [Keystone_7687]
WASHER8  3D printed washer  [Keystone_7687]
WASHER10  3D printed washer  [Keystone_7687]

### Blocks framed on the sheet
shield clips: CLIP1-CLIP30

### Sub-sheets
CPCIS_Connectors_P1_P6 = CPCIS_Connectors_P1_P6.SchDoc (file not in this document): BP_I2C (harness I2C), SERVMOD_3V3 (out), PSU_EN (out), PE_CLK (harness CLK_DIFF), BP_IO (harness EEM_LVDS), PGOOD (in)
EEM_Connectors = EEM_Connectors.SchDoc (file not in this document): EEM_IO (harness EEM_LVDS), BP_IO (harness EEM_LVDS), EEM0_I2C (harness I2C), BP_I2C (harness I2C), SERVMOD_3V3 (in), EEM0_I2C_FPGA (harness I2C), EEM1_I2C_FPGA (harness I2C)
U_B2B_Connectors = B2B_connectors.SchDoc: VCO_OUTM_0 (in), MEZZ_IO[15..0] (bidir), VCO_OUTM_1 (in), VCO_OUTM_2 (in), VCO_OUTM_3 (in), EEM0_I2C (harness I2C)
U_CLK_INPUT = CLK_INPUT.SchDoc: CK_SMA_IN (in), IN_SEL0 (in), VCO_CLK0_P (out), VCO_CLK1_P (out), IN_SEL1 (in), VCO_CLK2_P (out), VCO_CLK3_P (out), VCO_CLK0_N (out), VCO_CLK3_N (out), VCO_CLK2_N (out), VCO_CLK1_N (out), CK_SMA_GND (in), PE_CLK (harness CLK_DIFF)
U_FPGA = FPGA.SchDoc (file not in this document): FPGA_CFG (harness FPGA_CFG), SW0 (in), SW1 (in), EEM1_I2C (harness I2C), EEM0_I2C (harness I2C), EEM_IO (harness EEM_LVDS), RFSW_CTRL1 (out), RFSW_CTRL2 (out), RFSW_CTRL3 (out), RFSW_CTRL0 (out), VCO_CE[3..0] (out), VCO_SCKI[3..0] (out), VCO_SDI[3..0] (out), ATT_CLK_[3..0] (out), ATT_LE_[3..0] (out), ATT_RSTN_[3..0] (out), ATT_S_IN_[3..0] (out), ATT_S_OUT_[3..0] (in), LED[7..0] (out), VCO_MUXOUT[3..0] (in), VCO_LE[3..0] (out), IN_SEL0 (out), IN_SEL1 (out), MEZZ_IO[15..0] (bidir)
U_FPGA_Supply_Config = FPGA_Supply_Config.SchDoc (file not in this document): FPGA_CFG (harness FPGA_CFG), PGOOD (in), SW0 (out), SW1 (out), I2C (harness I2C)
U_PWR_Supply = Power_Supplies.SchDoc (file not in this document): PSU_EN (in), EEM0_I2C (harness I2C), PGOOD (out)
U_VCO_channel0 = VCO_channel.SchDoc: SCKI (in), SDI (in), CE (in), LE (in), VCO_OUT_P (out), VCO_OUT_N (out), MUXOUT (out), VCO_CLK_P (in), VCO_OUTM (out), VCO_CLK_N (in)
U_VCO_channel1 = VCO_channel.SchDoc: SCKI (in), SDI (in), LE (in), VCO_OUT_P (out), VCO_OUT_N (out), MUXOUT (out), CE (in), VCO_CLK_P (in), VCO_CLK_N (in), VCO_OUTM (out)
U_VCO_channel2 = VCO_channel.SchDoc: SCKI (in), SDI (in), LE (in), VCO_OUT_P (out), VCO_OUT_N (out), MUXOUT (out), CE (in), VCO_CLK_P (in), VCO_CLK_N (in), VCO_OUTM (out)
U_VCO_channel3 = VCO_channel.SchDoc: SCKI (in), SDI (in), LE (in), VCO_OUT_P (out), VCO_OUT_N (out), MUXOUT (out), CE (in), VCO_CLK_P (in), VCO_CLK_N (in), VCO_OUTM (out)
U_VCO_OUT_channel0 = VCO_OUT_channel.SchDoc: VCO_OUT_P (in), VCO_OUT_N (in), RF_OUT (out), RFSW_CTRL (in), ATT_CLK (in), ATT_S_IN (in), ATT_LE (in), ATT_RSTn (in), ATT_S_OUT (out)
U_VCO_OUT_channel1 = VCO_OUT_channel.SchDoc: VCO_OUT_P (in), VCO_OUT_N (in), RF_OUT (out), RFSW_CTRL (in), ATT_CLK (in), ATT_S_IN (in), ATT_LE (in), ATT_RSTn (in), ATT_S_OUT (out)
U_VCO_OUT_channel2 = VCO_OUT_channel.SchDoc: VCO_OUT_P (in), VCO_OUT_N (in), RF_OUT (out), RFSW_CTRL (in), ATT_CLK (in), ATT_S_IN (in), ATT_LE (in), ATT_RSTn (in), ATT_S_OUT (out)
U_VCO_OUT_channel3 = VCO_OUT_channel.SchDoc: VCO_OUT_P (in), VCO_OUT_N (in), RF_OUT (out), RFSW_CTRL (in), ATT_CLK (in), ATT_S_IN (in), ATT_LE (in), ATT_RSTn (in), ATT_S_OUT (out)

### Nets
GND: C11.2 C25.1 C31.2 C32.1 C33.2 C34.1 C35.2 C41.1 C48#1.2 C76.1 C82.2 CLIP1.1 CLIP2.1 CLIP3.1 CLIP4.1 CLIP5.1 CLIP6.1 CLIP7.1 CLIP8.1 CLIP9.1 CLIP10.1 CLIP11.1 CLIP12.1 CLIP13.1 CLIP14.1 CLIP15.1 CLIP16.1 CLIP17.1 CLIP18.1 CLIP19.1 CLIP20.1 CLIP21.1 CLIP22.1 CLIP23.1 CLIP24.1 CLIP25.1 CLIP26.1 CLIP27.1 CLIP28.1 CLIP29.1 CLIP30.1 LD2.1(C) LD2.3(C) LD5.1(C) LD5.3(C) LD6.1(C) LD6.3(C) LD8.1(C) LD8.3(C) NT1.2 NT2.2 NT3.2 NT4.2 NT5.2 NT6.2 NT7.2 NT8.2 NT9.2 NT10.2 NT11.2 NT12.2 NT13.2 NT14.2 NT15.2 NT16.2 NT17.2 NT18.2 NT19.2 NT20.2 R1#2.2 R7#1.2 R60.2 R64.2 R65.2 R74.2 R75.2 R92.1 R93.1 R94.1 R95.1 R97.1
STRIP1: B1.1 B2.1 C48#1.1 R1#2.1 R9#1.2  [also labelled CHASSIS]
ATT_S_OUT_0: R50.1
ATT_S_OUT_1: R101.1
ATT_S_OUT_2: R102.1
ATT_S_OUT_3: R147.1
IN_SEL0: sheet U_CLK_INPUT/IN_SEL0, sheet U_FPGA/IN_SEL0
IN_SEL1: sheet U_CLK_INPUT/IN_SEL1, sheet U_FPGA/IN_SEL1
LED0: R27.1
LED1: R28.1
LED2: R29.1
LED3: R30.1
LED4: R43.1
LED5: R44.1
LED6: R25.1
LED7: R26.1
RF_OUT0: J3.1 ; sheet U_VCO_OUT_channel0/RF_OUT
RF_OUT1: J4.1 ; sheet U_VCO_OUT_channel1/RF_OUT
RF_OUT2: J5.1 ; sheet U_VCO_OUT_channel2/RF_OUT
RF_OUT3: J6.1 ; sheet U_VCO_OUT_channel3/RF_OUT
RFSW_CTRL0: sheet U_VCO_OUT_channel0/RFSW_CTRL, sheet U_FPGA/RFSW_CTRL0
RFSW_CTRL1: sheet U_VCO_OUT_channel1/RFSW_CTRL, sheet U_FPGA/RFSW_CTRL1
RFSW_CTRL2: sheet U_VCO_OUT_channel2/RFSW_CTRL, sheet U_FPGA/RFSW_CTRL2
RFSW_CTRL3: sheet U_VCO_OUT_channel3/RFSW_CTRL, sheet U_FPGA/RFSW_CTRL3
SG0: C76.2 C82.1 J2.2 NT17.1 NT18.1 NT19.1 NT20.1 R60.1 R92.2 ; sheet U_CLK_INPUT/CK_SMA_GND
SG1: C11.1 C25.2 J3.2 NT1.1 NT2.1 NT3.1 NT4.1 R64.1 R93.2
SG2: C31.1 C32.2 J4.2 NT5.1 NT6.1 NT7.1 NT8.1 R65.1 R94.2
SG3: C33.1 C34.2 J5.2 NT9.1 NT10.1 NT11.1 NT12.1 R74.1 R95.2
SG4: C35.1 C41.2 J6.2 NT13.1 NT14.1 NT15.1 NT16.1 R75.1 R97.2
STRIP2: R7#1.1
STRIP3: R9#1.1
VCO_CLK0_N: sheet U_VCO_channel0/VCO_CLK_N, sheet U_CLK_INPUT/VCO_CLK0_N
VCO_CLK0_P: sheet U_VCO_channel0/VCO_CLK_P, sheet U_CLK_INPUT/VCO_CLK0_P
VCO_CLK1_N: sheet U_VCO_channel1/VCO_CLK_N, sheet U_CLK_INPUT/VCO_CLK1_N
VCO_CLK1_P: sheet U_VCO_channel1/VCO_CLK_P, sheet U_CLK_INPUT/VCO_CLK1_P
VCO_CLK2_N: sheet U_VCO_channel2/VCO_CLK_N, sheet U_CLK_INPUT/VCO_CLK2_N
VCO_CLK2_P: sheet U_VCO_channel2/VCO_CLK_P, sheet U_CLK_INPUT/VCO_CLK2_P
VCO_CLK3_N: sheet U_VCO_channel3/VCO_CLK_N, sheet U_CLK_INPUT/VCO_CLK3_N
VCO_CLK3_P: sheet U_VCO_channel3/VCO_CLK_P, sheet U_CLK_INPUT/VCO_CLK3_P
VCO_OUT_N: sheet U_VCO_channel0/VCO_OUT_N, sheet U_VCO_OUT_channel0/VCO_OUT_N
VCO_OUT_N: sheet U_VCO_OUT_channel1/VCO_OUT_N, sheet U_VCO_channel1/VCO_OUT_N  [a separate net that carries the same name]
VCO_OUT_N: sheet U_VCO_OUT_channel2/VCO_OUT_N, sheet U_VCO_channel2/VCO_OUT_N  [a separate net that carries the same name]
VCO_OUT_N: sheet U_VCO_OUT_channel3/VCO_OUT_N, sheet U_VCO_channel3/VCO_OUT_N  [a separate net that carries the same name]
VCO_OUT_P: sheet U_VCO_channel0/VCO_OUT_P, sheet U_VCO_OUT_channel0/VCO_OUT_P
VCO_OUT_P: sheet U_VCO_OUT_channel1/VCO_OUT_P, sheet U_VCO_channel1/VCO_OUT_P  [a separate net that carries the same name]
VCO_OUT_P: sheet U_VCO_OUT_channel2/VCO_OUT_P, sheet U_VCO_channel2/VCO_OUT_P  [a separate net that carries the same name]
VCO_OUT_P: sheet U_VCO_OUT_channel3/VCO_OUT_P, sheet U_VCO_channel3/VCO_OUT_P  [a separate net that carries the same name]
VCO_OUTM_0: sheet U_VCO_channel0/VCO_OUTM, sheet U_B2B_Connectors/VCO_OUTM_0  [project net VCO_OUTM]
VCO_OUTM_1: sheet U_VCO_channel1/VCO_OUTM, sheet U_B2B_Connectors/VCO_OUTM_1  [project net VCO_OUTM]
VCO_OUTM_2: sheet U_VCO_channel2/VCO_OUTM, sheet U_B2B_Connectors/VCO_OUTM_2  [project net VCO_OUTM]
VCO_OUTM_3: sheet U_VCO_channel3/VCO_OUTM, sheet U_B2B_Connectors/VCO_OUTM_3  [project net VCO_OUTM]
NetC196_1: J2.1 ; sheet U_CLK_INPUT/CK_SMA_IN
NetIC3A_19: R50.2 ; sheet U_VCO_OUT_channel0/ATT_S_OUT
NetIC3B_19: R101.2 ; sheet U_VCO_OUT_channel1/ATT_S_OUT
NetIC3C_19: R102.2 ; sheet U_VCO_OUT_channel2/ATT_S_OUT
NetIC3D_19: R147.2 ; sheet U_VCO_OUT_channel3/ATT_S_OUT
NetLD2_2: LD2.2(A) R25.2
NetLD2_4: LD2.4(A) R26.2
NetLD5_2: LD5.2(A) R27.2
NetLD5_4: LD5.4(A) R28.2
NetLD6_2: LD6.2(A) R29.2
NetLD6_4: LD6.4(A) R30.2
NetLD8_2: LD8.2(A) R43.2
NetLD8_4: LD8.4(A) R44.2
(unnamed): sheet U_PWR_Supply/PSU_EN, sheet CPCIS_Connectors_P1_P6/PSU_EN
(unnamed): sheet U_PWR_Supply/PGOOD, sheet CPCIS_Connectors_P1_P6/PGOOD, sheet U_FPGA_Supply_Config/PGOOD
(unnamed): sheet CPCIS_Connectors_P1_P6/SERVMOD_3V3, sheet EEM_Connectors/SERVMOD_3V3
(unnamed): sheet U_FPGA_Supply_Config/SW0, sheet U_FPGA/SW0
(unnamed): sheet U_FPGA_Supply_Config/SW1, sheet U_FPGA/SW1

### Buses and harness runs
bus ATT_CLK_[3..0] = sheet U_FPGA/ATT_CLK_[3..0]
bus ATT_LE_[3..0] = sheet U_FPGA/ATT_LE_[3..0]
bus ATT_RSTn_[3..0] = sheet U_FPGA/ATT_RSTN_[3..0]
bus ATT_S_IN_[3..0] = sheet U_FPGA/ATT_S_IN_[3..0]
bus ATT_S_OUT_[3..0] = sheet U_FPGA/ATT_S_OUT_[3..0]
bus LED[7..0] = sheet U_FPGA/LED[7..0]
bus MEZZ_IO[15..0] = sheet U_B2B_Connectors/MEZZ_IO[15..0]
bus MEZZ_IO[15..0] = sheet U_FPGA/MEZZ_IO[15..0]
bus VCO_CE[3..0] = sheet U_FPGA/VCO_CE[3..0]
bus VCO_LE[3..0] = sheet U_FPGA/VCO_LE[3..0]
bus VCO_MUXOUT[3..0] = sheet U_FPGA/VCO_MUXOUT[3..0]
bus VCO_SCKI[3..0] = sheet U_FPGA/VCO_SCKI[3..0]
bus VCO_SDI[3..0] = sheet U_FPGA/VCO_SDI[3..0]
harness EEM0_I2C = sheet EEM_Connectors/EEM0_I2C = sheet U_FPGA_Supply_Config/I2C = sheet U_PWR_Supply/EEM0_I2C
harness EEM0_I2C = sheet U_B2B_Connectors/EEM0_I2C
harness sheet CPCIS_Connectors_P1_P6/BP_I2C = sheet EEM_Connectors/BP_I2C
harness sheet CPCIS_Connectors_P1_P6/BP_IO = sheet EEM_Connectors/BP_IO
harness sheet CPCIS_Connectors_P1_P6/PE_CLK = sheet U_CLK_INPUT/PE_CLK
harness sheet EEM_Connectors/EEM0_I2C_FPGA = sheet U_FPGA/EEM0_I2C
harness sheet EEM_Connectors/EEM1_I2C_FPGA = sheet U_FPGA/EEM1_I2C
harness sheet EEM_Connectors/EEM_IO = sheet U_FPGA/EEM_IO
harness sheet U_FPGA/FPGA_CFG = sheet U_FPGA_Supply_Config/FPGA_CFG

### Layout directives
net class 50_Ohms: NetC196_1, RF_OUT0, RF_OUT1, RF_OUT2, RF_OUT3
net class VCO_CLK: VCO_CLK0_N, VCO_CLK0_P, VCO_CLK1_N, VCO_CLK1_P, VCO_CLK2_N, VCO_CLK2_P, VCO_CLK3_N, VCO_CLK3_P
net class ESD_STRIP: STRIP1, STRIP2, STRIP3

### Notes on the sheet
- Input frequency range:
  10MHz-2400MHz
- (near J2) Ext clock input
- I2C tree:
  {
  "MIRNY_MUX": {"path": [], "addr": 0x72},
  "AFE_EEPROM": {"path": [], "addr": 0x50},
  "MIRNY_LM75": {"path": [], "addr": 0x48},
  }
- (near LD5) VCO0 LEDs
- (near LD6) VCO1 LEDs
- Trace lengths matched within each of VCO_CLK[3:0], IO[7:4] (RF_SW ctrl lines)
- (near LD8) VCO2 LEDs
- (near WASHER2) SMA Insulating washers
- Output SMAs
- (near LD2) VCO3 LEDs
- Front panel and FMC slot spacers
- Chassis -> 1M1 -> GND in DIOT
  Direct grounding in Sinara
- ESD Protection
- ESD strips discharge resistors (CPCI-S.0 REQ 3.71)
- I2C
- JTAG
- MGT
- CLOCK
- LVDS
- Project/Equipment
- Document
- Designer
- Drawn by
- Check.by
- Last Mod.
- Contact
- File
- Print Date
- Sheet
- Size
- A2
- of
- Rev
- (in symbol LED_DIALIGHT_571-0112F, part A) BOT; Green
- (in symbol LED_DIALIGHT_571-0112F, part B) TOP; Red
- (in symbol R0402_100K_1%_0.0625W_100PPM) 1%
- (in symbol R0402_470R_1%_0.0625W_100PPM) 1%
- (in symbol R0805_1M1_1%_0.125W_100PPM) 1%
- (in symbol R0805_10M_1%_0.125W_100PPM_VISHAY_CRCW e3) 1%

### Library data of the parts
B1 B2 = PLATED_HOLE2.7_PAD5.0: Single Terminal Socket; Part Description: Plated Through Hole: Hole Dia.=2.7mm Pad Dia.=5.0mm; Mounted: No; Part Number: PLATED_HOLE2.7_PAD5.0; Component Type: Standard (No BOM); Pin Count: 1; Family: Plated Hole; Socket: No; SMD: No; Sense: No; Status: None; ComponentHeight: 0mm; HelpURL: Undefined; Author: CERN DEM JMW; CreateDate: 27.09.2011; LatestRevisionDate: 27.09.2011; PackageDescription: Plated Through Hole: Hole Dia.=2.7mm Pad Dia.=5.0mm
C11 C25 C31-C35 C41 C76 C82 = CC0402_10NF_16V_10%_X7R: Non-polarised capacitor; Part Description: SMD Multilayer Chip Ceramic Capacitor; Manufacturer: GENERIC; Manufacturer1 Part Number: 223878715636; Voltage: 16V; TC: X7R; Tolerance: ±10%; Part Number: CC0402_10NF_16V_10%_X7R; Component Kind: Standard; Component Type: Standard; Pin Count: 2; Value: 10nF; Status: Not Recommended; Manufacturer Part Number: CC0402_10NF_16V_10%_X7R; Case: 0402; Mounted: Yes; Socket: No; SMD: Yes; Sense: No; Manufacturer1 Example: PHYCOMP; Manufacturer1 ComponentHeight: 0.55mm; HelpURL: \\cern.ch\dfs\Applications\Altium\Datasheets\CC0402_X7R_PHYCOMP.pdf; Author: CERN DEM JLC; CreateDate: 2007-12-03; LatestRevisionDate: 2007-12-03
C48#1 = CC0402_22PF_50V_5%_C0G: Non-polarised capacitor; Part Description: SMD Multilayer Chip Ceramic Capacitor; Manufacturer: GENERIC; Manufacturer1 Part Number: C0402C220J5GACTU; Voltage: 50V; TC: C0G/NP0; Tolerance: ±5%; Part Number: CC0402_22PF_50V_5%_C0G; Component Kind: Standard; Component Type: Standard; Pin Count: 2; Value: 22pF; Status: Preferred; Manufacturer Part Number: CC0402_22PF_50V_5%_C0G; Case: 0402; Mounted: Yes; Socket: No; SMD: Yes; Manufacturer1 Example: KEMET; Manufacturer1 ComponentHeight: 0.55mm; HelpURL: \\cern.ch\dfs\Applications\Altium\Datasheets\CC0402_C0G_KEMET_(Commercial Grade).pdf; Author: CERN DEM JLC; CreateDate: 2007-12-03; LatestRevisionDate: 2007-12-03; Sense: No
CLIP1-CLIP30 = SHIELD_CLIP: Surface Mount Clip for PCB Screening Covers; Part Description: Surface Mount Clip for PCB Screening Covers, 1500 Serie; Manufacturer: HARWIN; PressFit: No; Table: Metal Screening Box; Part Number: S1411-46R; Component Kind: Standard; Component Type: Standard; Pin Count: 1; PackageDescription: Surface Mount Clip for PCB Screening Covers, 1500 Serie; Mounted: Yes; Socket: No; SMD: Yes; Status: None; Manufacturer Part Number: S1411-46R; ComponentHeight: 3.5mm; HelpURL: \\cern.ch\dfs\Applications\Altium\Datasheets\CLIP_HOLLAND-SHIELDING_LC.pdf; Author: CERN DEM JLC; CreateDate: 2013-06-25; LatestRevisionDate: 2013-06-25
FTG1 = FIDUCIAL_TARGET_C100-200: Fiducial Target; Part Description: Round Fiducial Target, Top Layer, 1.0mm, Top Solder 2.0mm, Keepout =2.0mm; Mounted: No; Part Number: FIDUCIAL_TARGET_C100-200; Component Type: Standard (No BOM); Pin Count: 1; Family: Fiducial; Socket: No; SMD: Yes; Sense: No; Status: None; ComponentHeight: 0mm; HelpURL: Undefined; Author: CERN DEM JLC; CreateDate: 09.02.2010; LatestRevisionDate: 04.04.2012; PackageDescription: Round Fiducial Target, Top Layer, 1.0mm, Top Solder 2.0mm, Keepout =2.0mm
FTG2 FTG4 = FIDUCIAL_TARGET_S100-200: Fiducial Target; Part Description: Square Fiducial Target, Top Layer, 1.0mm, Top Solder 2.0mm, Keepout =2.0mm; Mounted: No; Part Number: FIDUCIAL_TARGET_S100-200; Component Type: Standard (No BOM); Pin Count: 1; Family: Fiducial; Socket: No; SMD: Yes; Sense: No; Status: None; ComponentHeight: 0mm; HelpURL: Undefined; Author: CERN DEM JLC; CreateDate: 09.02.2010; LatestRevisionDate: 04.04.2012; PackageDescription: Square Fiducial Target, Top Layer, 1.0mm, Top Solder 2.0mm, Keepout =2.0mm
FTG3 = FIDUCIAL_TARGET_S200-400: Fiducial Target; Part Description: Square Fiducial Target, Top Layer, 2.0mm, Top Solder 4.0mm, Keepout =4.0mm; Mounted: No; Part Number: FIDUCIAL_TARGET_S200-400; Component Type: Standard (No BOM); Pin Count: 1; Family: Fiducial; Socket: No; SMD: Yes; Sense: No; Status: None; ComponentHeight: 0mm; HelpURL: Undefined; Author: CERN DEM JLC; CreateDate: 02.06.2008; LatestRevisionDate: 04.04.2012; PackageDescription: Square Fiducial Target, Top Layer, 2.0mm, Top Solder 4.0mm, Keepout =4.0mm
J2-J6 = DELOCK_65848: 50 Ohm Through Hole SMA Right Angle PCB Jack; Manufacturer Part Number: 5848 (4043619658480)
LD2 LD5 LD6 LD8 = LED_DIALIGHT_571-0112F: 2x LED  Botom Green, Top Red; Part Description: Dual 2mm  LEDs, Red Top,Green Bot, CBI® Circuit Board Indicator (Without positioning pins); PressFit: No; Bonding: No; Part Number: LED_DIALIGHT_571-0112F; Component Kind: Standard; Component Type: Standard; Color: Red/Green; PackageDescription: 2x 2mm LED (Top: Red, Bot: Green) PCB Edge Mounting (Without positioning pins) DIALIGHT 571 Serie; Manufacturer: DIALIGHT; Manufacturer Part Number: 571-0112F; Pin Count: 4; Mounted: Yes; Socket: No; SMD: No; Sense: No; ComponentHeight: 8.6mm; HelpURL: \\cern.ch\dfs\Applications\Altium\Datasheets\LED_DIALIGHT_571-0112F.pdf; Author: CERN DEM JLC; CreateDate: 09.11.2009; LatestRevisionDate: 17.03.2010
NT1-NT20 = Net Tie: Part Description: Net Tie (2 Nets); Mounted: No; Part Number: Net Tie; Component Type: Net Tie; Pin Count: 2; Family: Net Tie; Socket: No; SMD: No; Sense: No; Status: None; ComponentHeight: 0mm; HelpURL: Undefined; Author: CERN DEM JLC; CreateDate: 22.03.2011; LatestRevisionDate: 22.03.2011; PackageDescription: 2 Plated Through Hole For Coaxial Cable Link: Hole Dia.=1.4mm Pad Dia.=2.5mm
R1#2 = R0805_1M1_1%_0.125W_100PPM: Resistor - 1%; Part Description: General Purpose Thick Film Chip Resistor; Manufacturer: GENERIC; Manufacturer1 Part Number: NRC10F1104TRF; PressFit: No; Part Number: R0805_1M1_1%_0.125W_100PPM; Component Kind: Standard; Component Type: Standard; Pin Count: 2; Value: 1M1; Status: Preferred; Manufacturer Part Number: R0805_1M1_1%_0.125W_100PPM; Case: 0805; Mounted: Yes; Sense: No; Socket: No; SMD: Yes; Manufacturer1 Example: NIC COMPONENT; Manufacturer1 ComponentHeight: 0.6mm; HelpURL: \\cern.ch\dfs\Applications\Altium\Datasheets\R0805_NIC_NRC.pdf; Author: CERN DEM JLC; CreateDate: 03/12/2007; LatestRevisionDate: 13/03/2008
R7#1 R9#1 = R0805_10M_1%_0.125W_100PPM_VISHAY_CRCW e3: Resistor - 1%; Part Description: 150V, Standard Thick Film Chip Resistor; Manufacturer: VISHAY DALE; Manufacturer Part Number: CRCW080510M0FKEA; Power: 0.125W; TC: ±100ppm/°C; PressFit: No; Part Number: R0805_10M_1%_0.125W_100PPM_VISHAY_CRCW e3; Component Kind: Standard; Component Type: Standard; Pin Count: 2; Value: 10M; Status: None; Tolerance: ±1%; Case: 0805; Mounted: Yes; Sense: No; Socket: No; SMD: Yes; ComponentHeight: 0.5mm; HelpURL: \\cern.ch\dfs\Applications\Altium\Datasheets\R0805_VISHAY_CRCW e3.pdf; Author: CERN DEM BC; CreateDate: 2019-11-12; LatestRevisionDate: 2019-11-12
R25-R30 R43 R44 R50 R101 R102 R147 = R0402_470R_1%_0.0625W_100PPM: Resistor - 1%; Part Description: General Purpose Thick Film Chip Resistor; Manufacturer: GENERIC; Manufacturer1 Part Number: 232270674701L; TC: ±100ppm/°C; PressFit: No; Part Number: R0402_470R_1%_0.0625W_100PPM; Component Kind: Standard; Component Type: Standard; Pin Count: 2; Value: 470; Status: Not Recommended; Power: 0.0625W; Tolerance: ±1%; Manufacturer Part Number: R0402_470R_1%_0.0625W_100PPM; Case: 0402; Mounted: Yes; Sense: No; Socket: No; SMD: Yes; Manufacturer1 Example: YAGEO PHYCOMP; Manufacturer1 ComponentHeight: 0.4mm; HelpURL: \\cern.ch\dfs\Applications\Altium\Datasheets\R0402_Phycomp_RC0402.pdf; Author: CERN DEM JLC; CreateDate: 03.12.2007; LatestRevisionDate: 17.10.2012
R60 R64 R65 R74 R75 = R0402_100K_1%_0.0625W_100PPM: Resistor - 1%; Part Description: General Purpose Thick Film Chip Resistor; Manufacturer: GENERIC; Manufacturer1 Part Number: 232270671004L; PressFit: No; TC: ±100ppm/°C; Part Number: R0402_100K_1%_0.0625W_100PPM; Component Kind: Standard; Component Type: Standard; Pin Count: 2; Value: 100k; Status: Not Recommended; Manufacturer Part Number: R0402_100K_1%_0.0625W_100PPM; Case: 0402; Mounted: Yes; Sense: No; Socket: No; SMD: Yes; Manufacturer1 Example: YAGEO PHYCOMP; Manufacturer1 ComponentHeight: 0.4mm; HelpURL: \\cern.ch\dfs\Applications\Altium\Datasheets\R0402_Phycomp_RC0402.pdf; Author: CERN DEM JLC; CreateDate: 03.12.2007; LatestRevisionDate: 17.10.2012; Power: 0.0625W; Tolerance: ±1%
R92-R95 R97 = R0603_0R_JUMPER: Resistor; Part Description: 1A (0.05R Max DC Resistance) Zero Ohm Jumper; Manufacturer: GENERIC; Manufacturer1 Part Number: NRC06Z0; PressFit: No; Part Number: R0603_0R_JUMPER; Component Kind: Standard; Component Type: Standard; Pin Count: 2; Value: 0; Status: Preferred; Manufacturer Part Number: R0603_0R_JUMPER; Case: 0603; Mounted: Yes; Sense: No; Socket: No; SMD: Yes; Manufacturer1 Example: NIC COMPONENT; Manufacturer1 ComponentHeight: 0.55mm; HelpURL: \\cern.ch\dfs\Applications\Altium\Datasheets\R0603_NIC_NRC.pdf; Author: CERN DEM JLC; CreateDate: 03.12.2007; LatestRevisionDate: 13.03.2008
ST1 = SCHROFF_PANEL_6HP_4U: Schroff 6HP 4U EUROCARD Panel; Manufacturer Part Number: 20818-020; Manufacturer: Schroff; Manufacturer Part Number 2: 20848-666
WASHER2 WASHER4 WASHER6 WASHER8 WASHER10 = Keystone_7687: SMA_Shoulder Washer; Part Description: Polyphenylene Sulfide PPS Shoulder Washer; Manufacturer: Homemade; PressFit: No; Value: D11.1xd6.6; Part Number: 3D printed washer; Component Kind: Standard; Component Type: Mechanical; Footprint: 3D printed washer; Pin Count: 0; PackageDescription: Polyphenylene Sulfide PPS Shoulder Washer; Mounted: Yes; Socket: No; SMD: No; Sense: No; Status: None; Manufacturer Part Number: 3D printed washer; ComponentHeight: 1.91mm; HelpURL: \\cern.ch\dfs\Applications\Altium\Datasheets\AAVID-THERMALLOY_7721-7PPSG.pdf; Author: GK; CreateDate: 28.01.2016; LatestRevisionDate: 28.01.2016